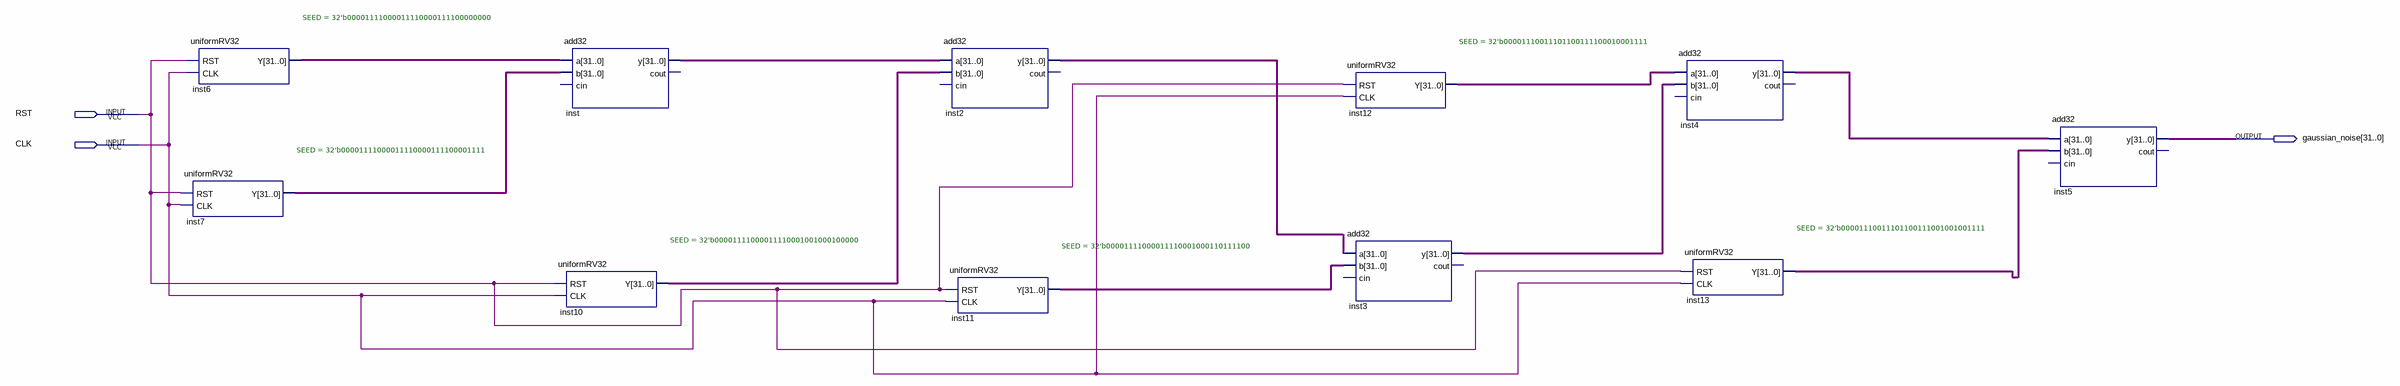
[diagram p0: schematic sheet]
// Quartus schematic additive_Gaussian_noise.bdf as structural Verilog: 11 symbols, 3 pins
module additive_Gaussian_noise (
  input  RST,
  input  CLK,
  output [31:0] gaussian_noise
);

  wire [31:0] inst2_y, inst3_y, inst4_y, inst6_y, inst7_y, inst10_y, inst11_y, inst12_y, inst13_y, inst_y;

  uniformRV32 #(.SEED(32'b00001111000011110000111100000000)) inst6 (.RST(RST), .CLK(CLK), .Y(inst6_y));
  uniformRV32 #(.SEED(32'b00001111000011110000111100001111)) inst7 (.RST(RST), .CLK(CLK), .Y(inst7_y));
  add32 inst (.a(inst6_y), .b(inst7_y), .y(inst_y));  // open: cin, cout
  uniformRV32 #(.SEED(32'b00001111000011110001001000100000)) inst10 (.RST(RST), .CLK(CLK), .Y(inst10_y));
  add32 inst2 (.a(inst_y), .b(inst10_y), .y(inst2_y));  // open: cin, cout
  uniformRV32 #(.SEED(32'b00001111000011110001000110111100)) inst11 (.RST(RST), .CLK(CLK), .Y(inst11_y));
  uniformRV32 #(.SEED(32'b00001110011101100111100010001111)) inst12 (.RST(RST), .CLK(CLK), .Y(inst12_y));
  add32 inst3 (.a(inst2_y), .b(inst11_y), .y(inst3_y));  // open: cin, cout
  add32 inst4 (.a(inst12_y), .b(inst3_y), .y(inst4_y));  // open: cin, cout
  uniformRV32 #(.SEED(32'b00001110011101100111001001001111)) inst13 (.RST(RST), .CLK(CLK), .Y(inst13_y));
  add32 inst5 (.a(inst4_y), .b(inst13_y), .y(gaussian_noise));  // open: cin, cout
endmodule
